# EAGLE design Nucleo_DCO_EX1 (EAGLE 9.0.1)
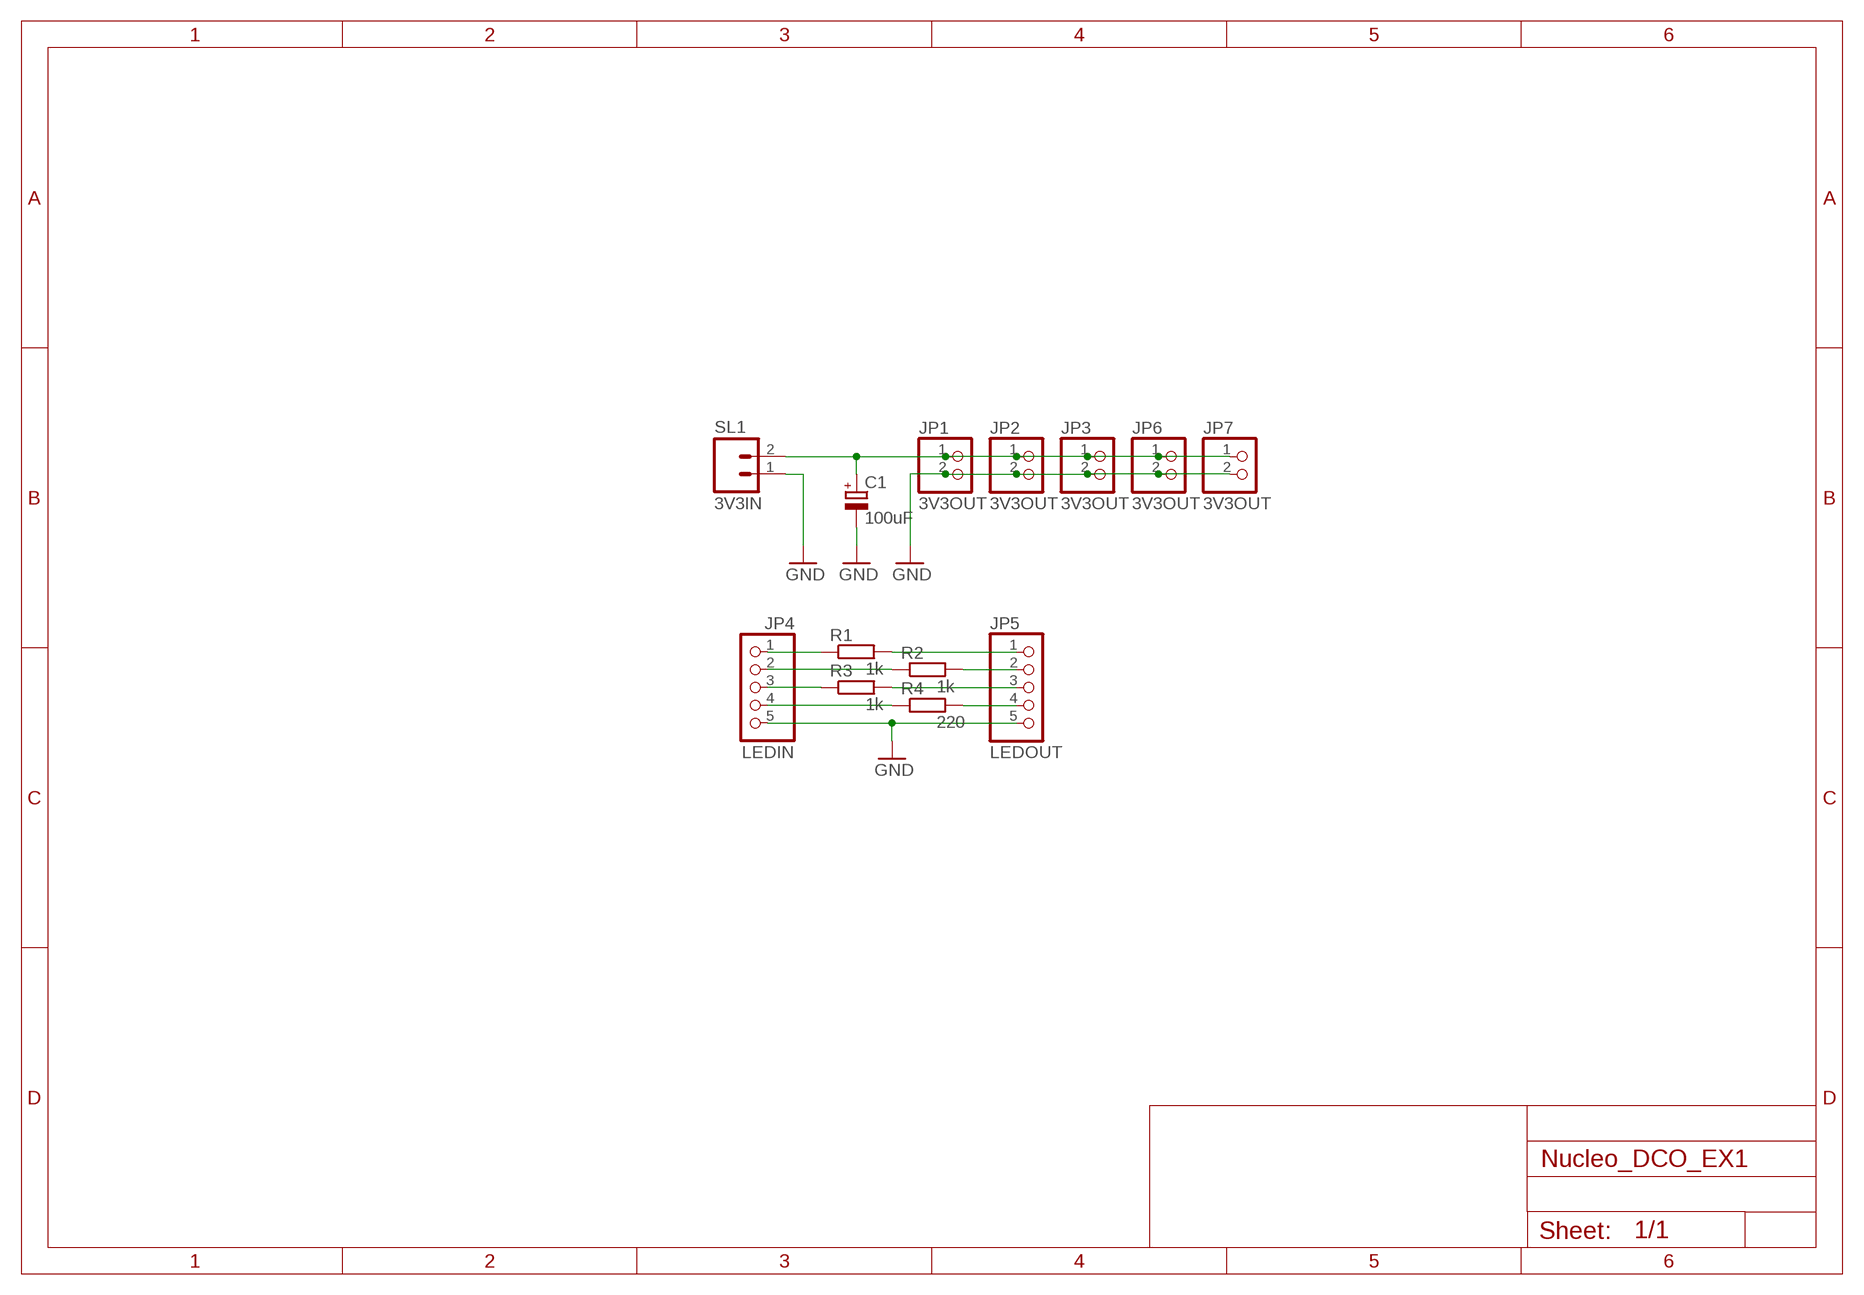
[diagram p0: schematic, sheet 1]

## Parts
C1  100uF  CPOL-EUSANYO_C6  [SANYO-OSCON_C6]
JP1  3V3OUT  PINHD-1X2  [1X02]
JP2  3V3OUT  PINHD-1X2  [1X02]
JP3  3V3OUT  PINHD-1X2  [1X02]
JP4  LEDIN  PINHD-1X5  [1X05]
JP5  LEDOUT  PINHD-1X5  [1X05]
JP6  3V3OUT  PINHD-1X2  [1X02]
JP7  3V3OUT  PINHD-1X2  [1X02]
R1  1k  R-EU_0207/7  [0207/7]
R2  1k  R-EU_0207/7  [0207/7]
R3  1k  R-EU_0207/7  [0207/7]
R4  220  R-EU_0207/7  [0207/7]
SL1  3V3IN  M02  [02P]

## Nets
GND: C1.- JP1.2 JP2.2 JP3.2 JP4.5 JP5.5 JP6.2 JP7.2 SL1.1
N$1: C1.+ JP1.1 JP2.1 JP3.1 JP6.1 JP7.1 SL1.2
N$2: JP4.1 R1.1
N$3: JP5.1 R1.2
N$4: JP4.2 R2.1
N$5: JP5.2 R2.2
N$6: JP4.3 R3.1
N$7: JP5.3 R3.2
N$8: JP4.4 R4.1
N$9: JP5.4 R4.2

## Library data of the parts
C1 = rcl:CPOL-EU: POLARIZED CAPACITOR, European symbol; SPICEPREFIX: C
JP1-JP3 JP6 JP7 = pinhead:PINHD-1X2: PIN HEADER
JP4 JP5 = pinhead:PINHD-1X5: PIN HEADER
R1-R4 = rcl:R-EU_: RESISTOR, European symbol; SPICEPREFIX: R
SL1 = con-amp-quick:M02: AMP QUICK CONNECTOR; OC_FARNELL: unknown; OC_NEWARK: unknown

## Board
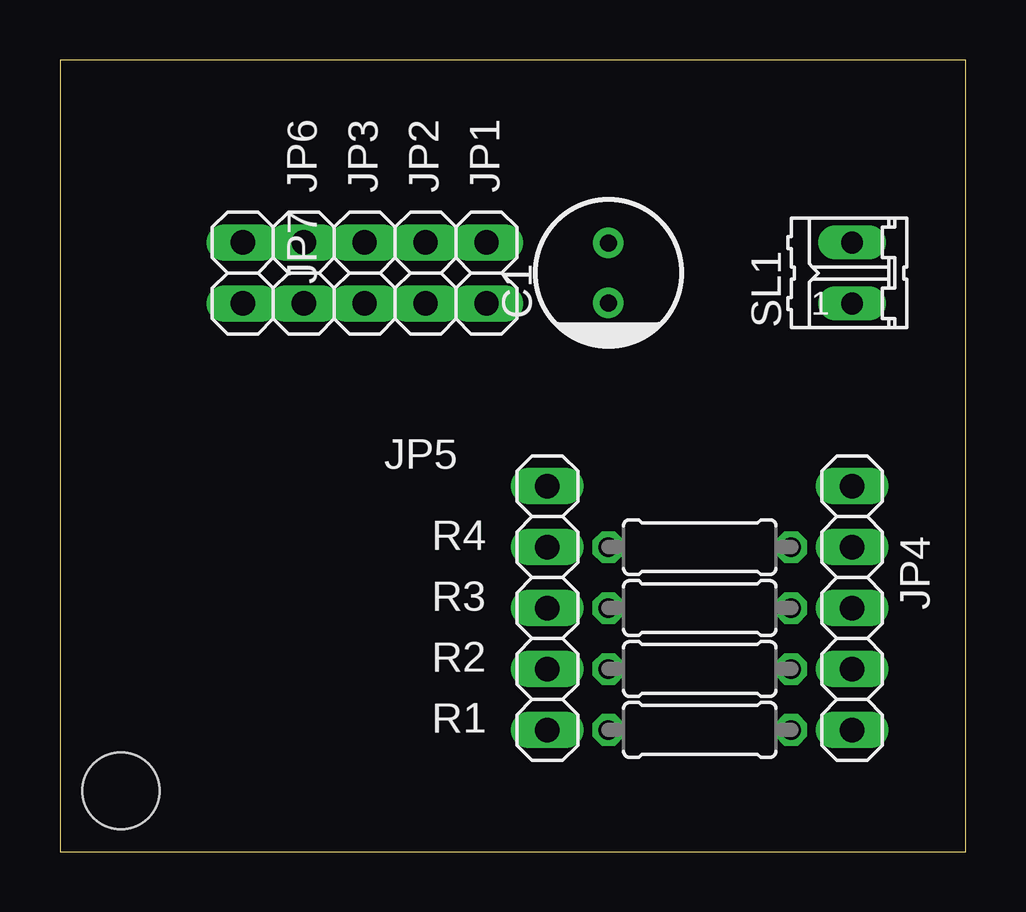
[diagram p1: board, top side]
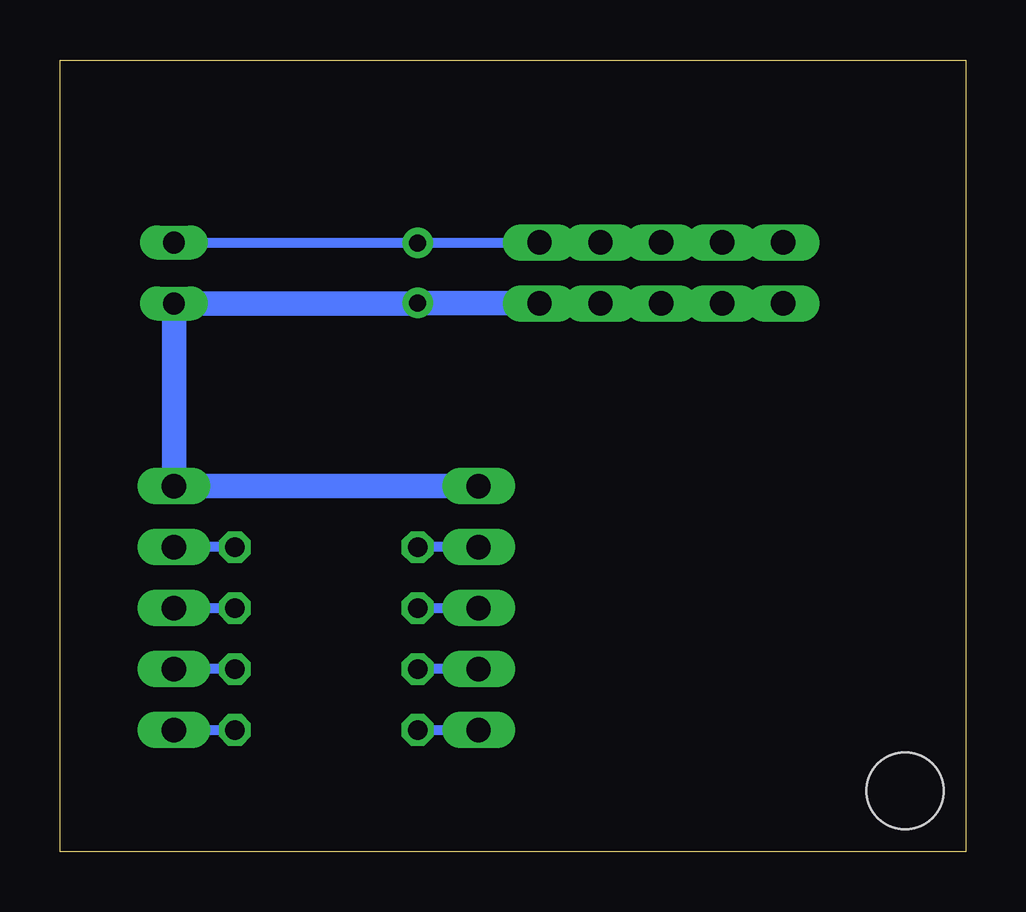
[diagram p2: board, bottom side, seen from below]

Size 37.77 x 33.01 mm. Coordinates in mm from the lower left corner, seen from the top.
Outline: 0,0 37.77,0 37.77,33.01 0,33.01 0,0
Copper layers (1*16): Top 0.035mm / dielectric 1.5mm / Bottom 0.035mm
Design rules "default": minimum track width 6mil, minimum drill 0.35mm, track to track 6mil, track to pad 6mil, pad to pad 6mil, via to via 6mil, smd to smd 6mil, copper to edge 40mil, drill to drill 6mil, minimum pad ring 10mil, minimum via ring 8mil, stop-mask expansion 4mil, vias tented up to drill 0mil, thermal gap 10mil
Holes 3.2 mm at 2.54,2.54

### Footprints (pad centres in the part's own frame; a part is rotated, then mirrored left to right if it is on the bottom)
SANYO-OSCON_C6 = drill 0.7 pad 1.27: + 1.25,0; - -1.25,0
1X02 = drill 1.016 long: 1 -1.27,0; 2 1.27,0
1X05 = drill 1.016 long: 1 -5.08,0; 2 -2.54,0; 3 0,0; 4 2.54,0; 5 5.08,0
0207/7 = drill 0.813 octagon: 1 -3.81,0; 2 3.81,0
02P = drill 0.914 long: 1 -1.27,0; 2 1.27,0

### Placement (x,y rotation side)
C1  22.86,24.13 90 top
JP1  17.78,24.13 270 top
JP2  15.24,24.13 270 top
JP3  12.7,24.13 270 top
JP4  33.02,10.16 90 top
JP5  20.32,10.16 90 top
JP6  10.16,24.13 270 top
JP7  7.62,24.13 270 top
R1  26.67,5.08 180 top
R2  26.67,7.62 180 top
R3  26.67,10.16 180 top
R4  26.67,12.7 180 top
SL1  33.02,24.13 90 top

### Tracks (layer width: path | path; a pad name or v marks a point on that pad's centre or on a via)
GND
  Bottom 0.406: 17.8,22.88 JP1.2 | 22.86,22.86 C1.-
  Bottom 1.016: JP1.2 JP2.2 JP3.2 JP6.2 JP7.2 | JP5.5 JP4.5 SL1.1 22.86,22.86 | C1.- 17.8,22.88
N$1
  Bottom 0.406: SL1.2 22.86,25.4 C1.+ 17.8,25.38 JP1.1 JP2.1 JP3.1 JP6.1 JP7.1
N$2
  Bottom 0.406: JP4.1 R1.1
N$3
  Bottom 0.406: R1.2 JP5.1
N$4
  Bottom 0.406: R2.1 JP4.2
N$5
  Bottom 0.406: JP5.2 R2.2
N$6
  Bottom 0.406: JP4.3 R3.1
N$7
  Bottom 0.406: R3.2 JP5.3
N$8
  Bottom 0.406: R4.1 JP4.4
N$9
  Bottom 0.406: JP5.4 R4.2